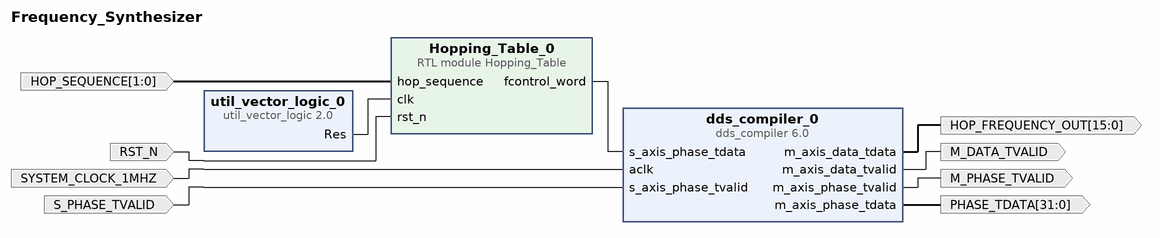
[diagram p0: block diagram of the top level]
# Vivado block design Frequency_Synthesizer, xczu47dr-ffve1156-2-e, Vivado 2021.1
create_bd_design Frequency_Synthesizer

create_bd_port -dir I -type clk SYSTEM_CLOCK_1MHZ
set_property -dict {CONFIG.FREQ_HZ 1000000} [get_bd_ports SYSTEM_CLOCK_1MHZ]
create_bd_port -dir I -type rst RST_N
create_bd_port -dir I -from 1 -to 0 -type data HOP_SEQUENCE
create_bd_port -dir O -from 15 -to 0 -type data HOP_FREQUENCY_OUT
create_bd_port -dir I S_PHASE_TVALID
create_bd_port -dir O -from 31 -to 0 PHASE_TDATA
create_bd_port -dir O M_PHASE_TVALID
create_bd_port -dir O M_DATA_TVALID

create_bd_cell -type ip -vlnv xilinx.com:ip:dds_compiler:6.0 dds_compiler_0
set_property -dict [list \
  CONFIG.DATA_Has_TLAST Not_Required \
  CONFIG.DDS_Clock_Rate 160 \
  CONFIG.Frequency_Resolution 0.4 \
  CONFIG.Latency 3 \
  CONFIG.M_DATA_Has_TUSER Not_Required \
  CONFIG.M_PHASE_Has_TUSER Not_Required \
  CONFIG.Mode_of_Operation Standard \
  CONFIG.Noise_Shaping Auto \
  CONFIG.Output_Frequency1 0 \
  CONFIG.Output_Selection Sine_and_Cosine \
  CONFIG.Output_Width 8 \
  CONFIG.PINC1 0 \
  CONFIG.Parameter_Entry System_Parameters \
  CONFIG.Phase_Increment Streaming \
  CONFIG.Phase_Width 29 \
  CONFIG.Resync false \
  CONFIG.S_PHASE_Has_TUSER Not_Required \
  CONFIG.Spurious_Free_Dynamic_Range 48 \
] [get_bd_cells dds_compiler_0]
create_bd_cell -type module -reference Hopping_Table Hopping_Table_0
create_bd_cell -type ip -vlnv xilinx.com:ip:util_vector_logic:2.0 util_vector_logic_0
set_property -dict {CONFIG.C_OPERATION not CONFIG.C_SIZE 1} [get_bd_cells util_vector_logic_0]

# ---- connections ----

connect_bd_net [get_bd_ports HOP_SEQUENCE] [get_bd_pins Hopping_Table_0/hop_sequence]
connect_bd_net [get_bd_pins Hopping_Table_0/fcontrol_word] [get_bd_pins dds_compiler_0/s_axis_phase_tdata]
connect_bd_net [get_bd_ports RST_N] [get_bd_pins Hopping_Table_0/rst_n]
connect_bd_net [get_bd_ports SYSTEM_CLOCK_1MHZ] [get_bd_pins dds_compiler_0/aclk]
connect_bd_net [get_bd_ports S_PHASE_TVALID] [get_bd_pins dds_compiler_0/s_axis_phase_tvalid]
connect_bd_net [get_bd_pins dds_compiler_0/m_axis_data_tdata] [get_bd_ports HOP_FREQUENCY_OUT]
connect_bd_net [get_bd_pins dds_compiler_0/m_axis_data_tvalid] [get_bd_ports M_DATA_TVALID]
connect_bd_net [get_bd_pins dds_compiler_0/m_axis_phase_tdata] [get_bd_ports PHASE_TDATA]
connect_bd_net [get_bd_pins dds_compiler_0/m_axis_phase_tvalid] [get_bd_ports M_PHASE_TVALID]
connect_bd_net [get_bd_pins util_vector_logic_0/Res] [get_bd_pins Hopping_Table_0/clk]

validate_bd_design
save_bd_design
